# Altium schematic sheet VCO.SchDoc
size A4
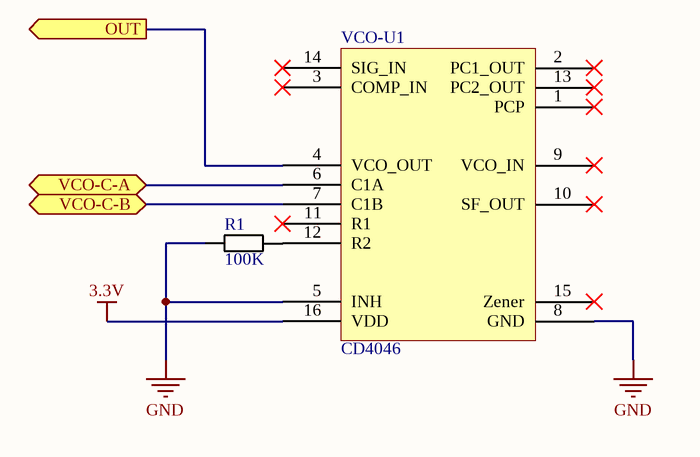
[diagram p0: VCO.SchDoc]

## Parts
R1  100K  [R 0805 / 2012]
VCO-U1  CD4046  [SOIC-16]

## Ports
OUT (out), VCO-C-A (bidir), VCO-C-B (bidir)

## Nets
3.3V: VCO-U1.16(VDD)
GND: R1.2 VCO-U1.5(INH) VCO-U1.8(GND)
OUT: VCO-U1.4(VCO_OUT) ; port OUT
VCO-C-A: VCO-U1.6(C1A) ; port VCO-C-A
VCO-C-B: VCO-U1.7(C1B) ; port VCO-C-B
NetR1_1: R1.1 VCO-U1.12(R2)

Not connected (* = marked no-connect by the designer): VCO-U1 1(PCP)* 2(PC1_OUT)* 3(COMP_IN)* 9(VCO_IN)* 10(SF_OUT)* 11(R1)* 13(PC2_OUT)* 14(SIG_IN)* 15(Zener)*

## Library data of the parts
R1 = Resistor
VCO-U1 = CD4046: PLL / VCO